# EAGLE design h-bridge mosfets ver AB (EAGLE 7.7.0)
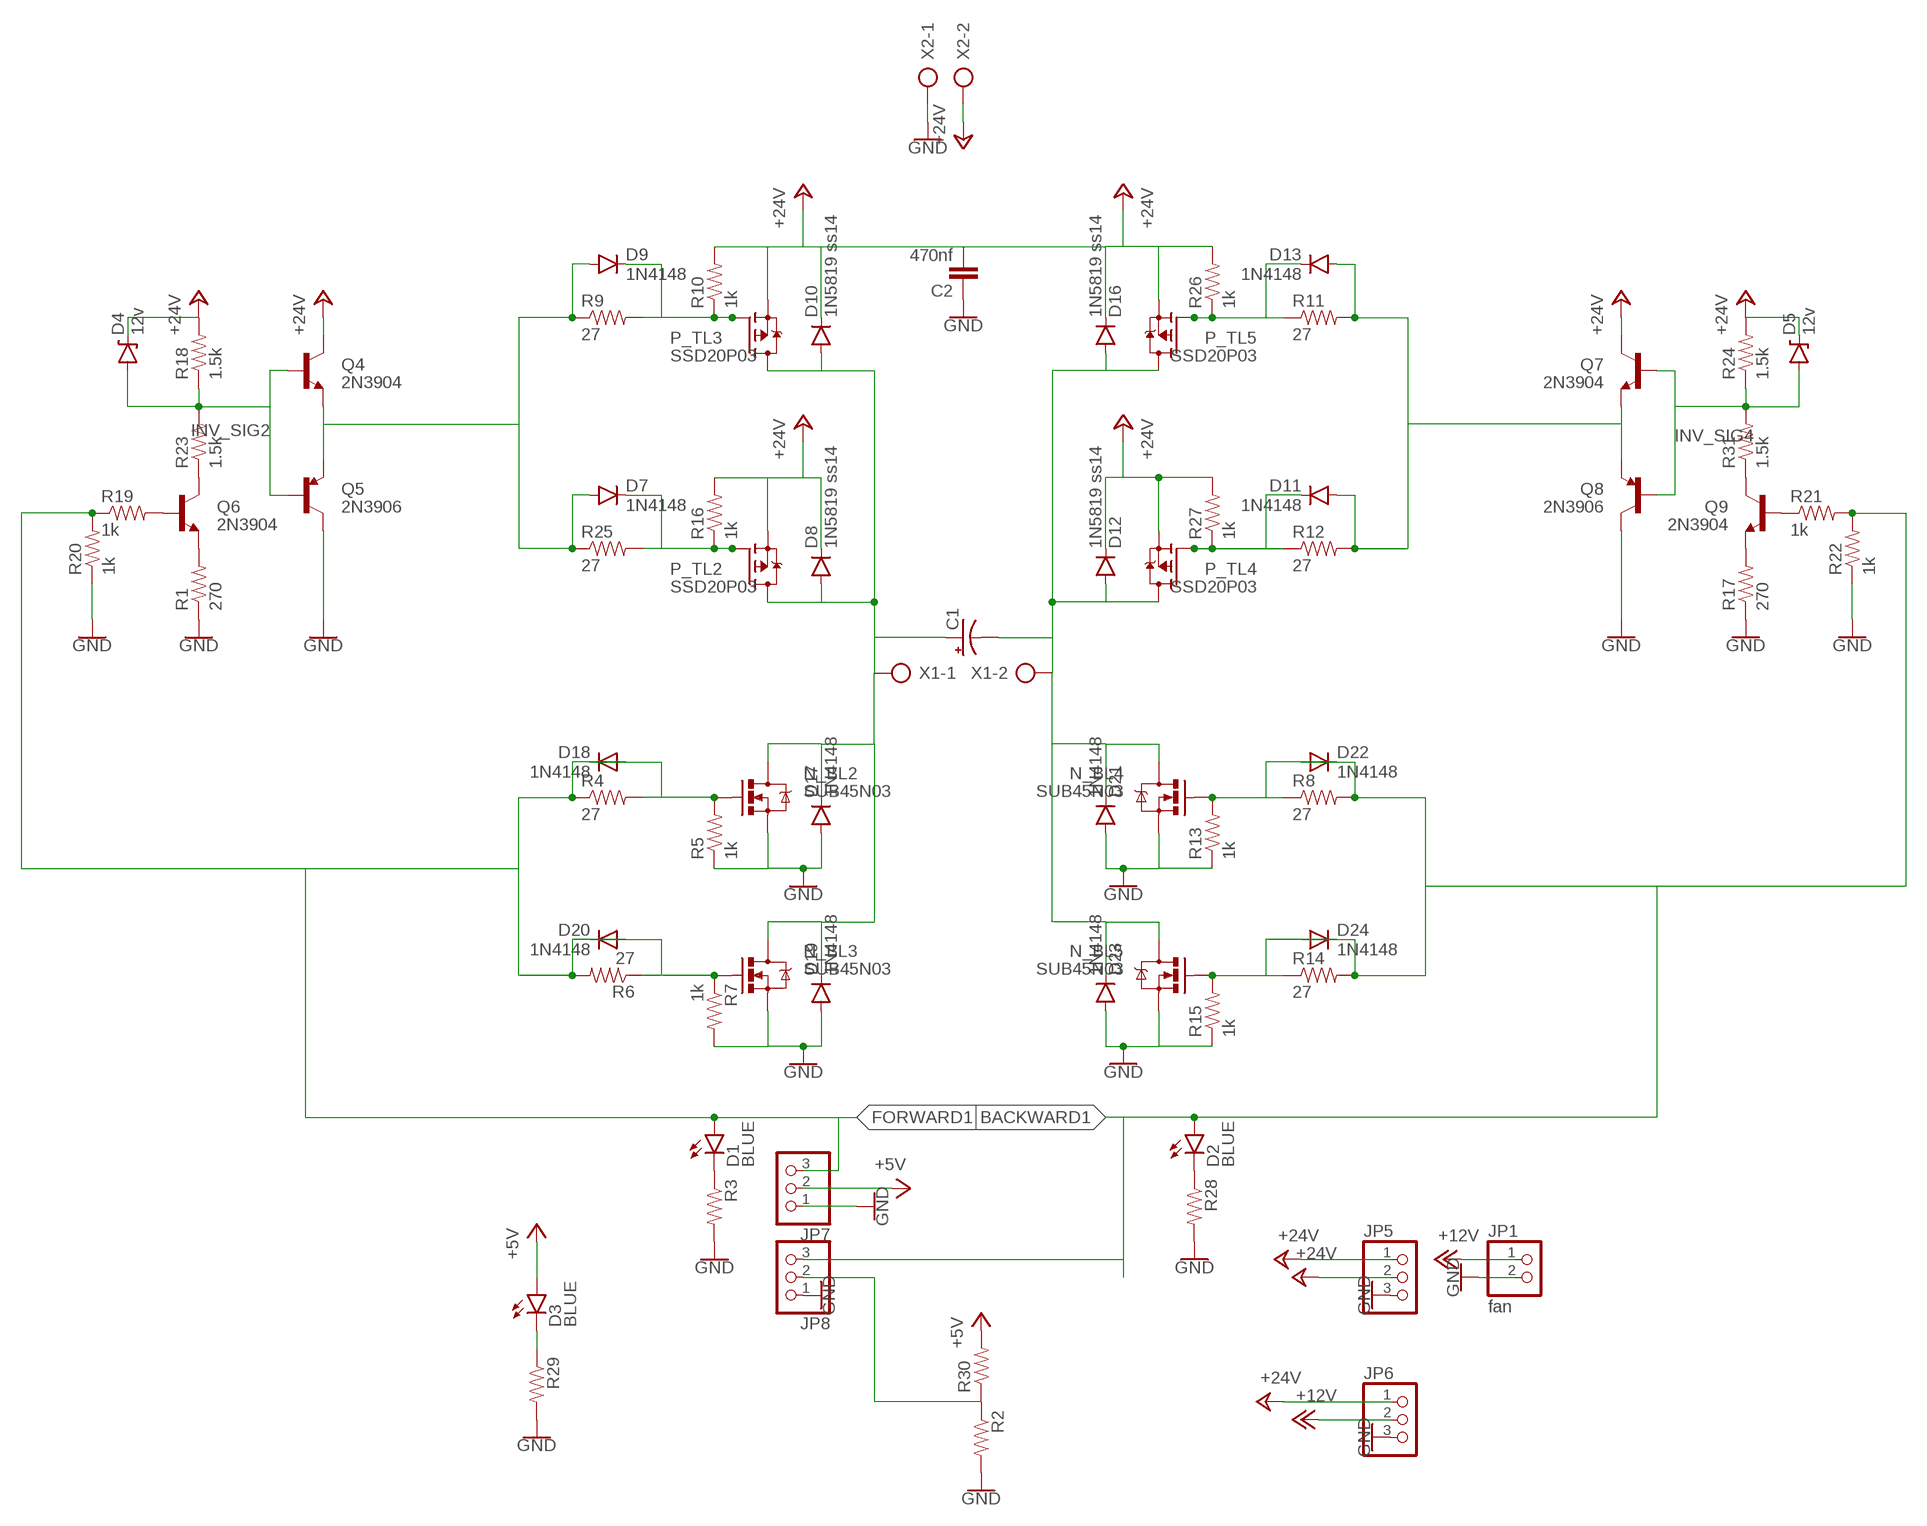
[diagram p0: schematic, sheet 1]

## Parts
C1  1000UF-25V(PTH)  [CPOL-RADIAL-1000UF-25V]
C2  470nf  1.0UF50V10%(1206)  [1206]
D1  BLUE  LED-BLUE1206  [LED-1206]
D2  BLUE  LED-BLUE1206  [LED-1206]
D3  BLUE  LED-BLUE1206  [LED-1206]
D4  12v  DIODE-ZENERSMB  [SMB-DIODE]
D5  12v  DIODE-ZENERSMB  [SMB-DIODE]
D7  1N4148  DIODESOD123  [SOD-123]
D8  1N5819 ss14  DIODESOD123  [SOD-123]
D9  1N4148  DIODESOD123  [SOD-123]
D10  1N5819 ss14  DIODESOD123  [SOD-123]
D11  1N4148  DIODESOD123  [SOD-123]
D12  1N5819 ss14  DIODESOD123  [SOD-123]
D13  1N4148  DIODESOD123  [SOD-123]
D16  1N5819 ss14  DIODESOD123  [SOD-123]
D17  1N4148  DIODESOD123  [SOD-123]
D18  1N4148  DIODESOD123  [SOD-123]
D19  1N4148  DIODESOD123  [SOD-123]
D20  1N4148  DIODESOD123  [SOD-123]
D21  1N4148  DIODESOD123  [SOD-123]
D22  1N4148  DIODESOD123  [SOD-123]
D23  1N4148  DIODESOD123  [SOD-123]
D24  1N4148  DIODESOD123  [SOD-123]
JP1  fan  PINHD-1X2  [1X02]
JP5  PINHD-1X3  [1X03]
JP6  PINHD-1X3  [1X03]
JP7  PINHD-1X3  [1X03]
JP8  PINHD-1X3  [1X03]
N_BL2  SUB45N03  MOSFET-NCHANNELPSMN7R0  [TO-263/D2PAK]
N_BL3  SUB45N03  MOSFET-NCHANNELPSMN7R0  [TO-263/D2PAK]
N_BL4  SUB45N03  MOSFET-NCHANNELPSMN7R0  [TO-263/D2PAK]
N_BL5  SUB45N03  MOSFET-NCHANNELPSMN7R0  [TO-263/D2PAK]
P_TL2  SSD20P03  FDD4141TO252  [TO252]
P_TL3  SSD20P03  FDD4141TO252  [TO252]
P_TL4  SSD20P03  FDD4141TO252  [TO252]
P_TL5  SSD20P03  FDD4141TO252  [TO252]
Q4  2N3904  TRANSISTOR_NPNMMBT5088  [SOT23-3]
Q5  2N3906  TRANSISTOR_PNPPMBT3906  [SOT23-3]
Q6  2N3904  TRANSISTOR_NPNMMBT5088  [SOT23-3]
Q7  2N3904  TRANSISTOR_NPNMMBT5088  [SOT23-3]
Q8  2N3906  TRANSISTOR_PNPPMBT3906  [SOT23-3]
Q9  2N3904  TRANSISTOR_NPNMMBT5088  [SOT23-3]
R1  270  0.3OHM-1/8W-1%(0805)  [0805]
R2  0.3OHM-1/8W-1%(0805)  [0805]
R3  0.3OHM-1/8W-1%(0805)  [0805]
R4  27  0.3OHM-1/8W-1%(0805)  [0805]
R5  1k  0.3OHM-1/8W-1%(0805)  [0805]
R6  27  0.3OHM-1/8W-1%(0805)  [0805]
R7  1k  0.3OHM-1/8W-1%(0805)  [0805]
R8  27  0.3OHM-1/8W-1%(0805)  [0805]
R9  27  0.3OHM-1/8W-1%(0805)  [0805]
R10  1k  0.3OHM-1/8W-1%(0805)  [0805]
R11  27  0.3OHM-1/8W-1%(0805)  [0805]
R12  27  0.3OHM-1/8W-1%(0805)  [0805]
R13  1k  0.3OHM-1/8W-1%(0805)  [0805]
R14  27  0.3OHM-1/8W-1%(0805)  [0805]
R15  1k  0.3OHM-1/8W-1%(0805)  [0805]
R16  1k  0.3OHM-1/8W-1%(0805)  [0805]
R17  270  0.3OHM-1/8W-1%(0805)  [0805]
R18  1.5k  0.3OHM-1/8W-1%(0805)  [0805]
R19  1k  0.3OHM-1/8W-1%(0805)  [0805]
R20  1k  0.3OHM-1/8W-1%(0805)  [0805]
R21  1k  0.3OHM-1/8W-1%(0805)  [0805]
R22  1k  0.3OHM-1/8W-1%(0805)  [0805]
R23  1.5k  0.3OHM-1/8W-1%(0805)  [0805]
R24  1.5k  0.3OHM-1/8W-1%(0805)  [0805]
R25  27  0.3OHM-1/8W-1%(0805)  [0805]
R26  1k  0.3OHM-1/8W-1%(0805)  [0805]
R27  1k  0.3OHM-1/8W-1%(0805)  [0805]
R28  0.3OHM-1/8W-1%(0805)  [0805]
R29  0.3OHM-1/8W-1%(0805)  [0805]
R30  RESISTORPTH-1/4W-VERT-KIT  [AXIAL-0.1EZ]
R31  1.5k  0.3OHM-1/8W-1%(0805)  [0805]
X1  AK300/2  [AK300/2]
X2  AK300/2  [AK300/2]

## Nets
+5V: D3.A JP7.2 R30.P$2
+12V: JP1.1 JP6.2
+24V: C2.2 D4.C D5.C D8.C D10.C D12.C D16.C JP5.1 JP5.2 JP6.1 P_TL2.2(S) P_TL3.2(S) P_TL4.2(S) P_TL5.2(S) Q4.3(C) Q7.3(C) R10.2 R16.2 R18.2 R24.2 R26.2 R27.2 X2.2
BACKWARD1: D2.A D22.A D24.A JP8.3 R8.2 R14.2 R21.2 R22.2
DR2: D11.A D13.A Q7.2(E) Q8.2(E) R11.2 R12.2
FORWARD1: D1.A D18.A D20.A JP7.3 R4.1 R6.2 R19.1 R20.2
GND: C2.1 D17.A D19.A D21.A D23.A JP1.2 JP5.3 JP6.3 JP7.1 JP8.1 N_BL2.3(S) N_BL3.3(S) N_BL4.3(S) N_BL5.3(S) Q5.3(C) Q8.3(C) R1.1 R2.2 R3.2 R5.1 R7.2 R13.1 R15.1 R17.1 R20.1 R22.1 R28.2 R29.2 X2.1
INV_SIG2: D4.A Q4.1(B) Q5.1(B) R18.1 R23.2
INV_SIG4: D5.A Q7.1(B) Q8.1(B) R24.1 R31.2
LEFT: C1.- D12.A D16.A D21.C D23.C N_BL4.2(D) N_BL5.2(D) P_TL4.3(D) P_TL5.3(D) X1.2
N$1: Q6.2(E) R1.2
N$2: Q6.1(B) R19.2
N$3: Q9.1(B) R21.1
N$4: Q9.2(E) R17.2
N$5: D1.C R3.1
N$6: D2.C R28.1
N$7: D3.C R29.1
N$8: D7.C P_TL2.1(G) R16.1 R25.2
N$9: D20.C N_BL3.1(G) R6.1 R7.1
N$10: JP8.2 R2.1 R30.P$1
N$11: D9.C P_TL3.1(G) R9.2 R10.1
N$12: D22.C N_BL4.1(G) R8.1 R13.2
N$13: Q6.3(C) R23.1
N$14: D11.C P_TL4.1(G) R12.1 R27.1
N$15: Q9.3(C) R31.1
N$16: D13.C P_TL5.1(G) R11.1 R26.1
N$17: D7.A D9.A Q4.2(E) Q5.2(E) R9.1 R25.1
N$19: D18.C N_BL2.1(G) R4.2 R5.2
N$21: D24.C N_BL5.1(G) R14.1 R15.2
RIGHT: C1.+ D8.A D10.A D17.C D19.C N_BL2.2(D) N_BL3.2(D) P_TL2.3(D) P_TL3.3(D) X1.1

## Library data of the parts
C1 = SparkFun-Capacitors:1000UF-25V(PTH): CAP-08070; PROD_ID: CAP-09538; VALUE: CAP-09538
C2 = SparkFun-Capacitors:1.0UF50V10%(1206): CAP-09822; PROD_ID: CAP-09822; VALUE: 1.0uF
D1-D3 = SparkFun-LED:LED-BLUE: Blue LEDs for production use Various blue LEDs stocked by SparkFun production 0603 - DIO-08575 Rebel - DIO-09553 1206 - DIO-09911; PROD_ID: DIO-09911
D4 D5 = SparkFun-DiscreteSemi:DIODE-ZENER: Zener Diode Production Part - 8199 3.4V Zener Voltage
D7-D13 D16-D24 = SparkFun-DiscreteSemi:DIODE: Diode These are standard reverse protection diodes and small signal diodes. SMA package can handle up to about 1A. SOD-323 can handle about 200mA. What the SOD-323 package when ordering, there are some mfgs out there that are 5-pin packages.
JP1 = pinhead2:PINHD-1X2: PIN HEADER
JP5-JP8 = pinhead:PINHD-1X3: PIN HEADER
N_BL2-N_BL5 = SparkFun-DiscreteSemi:MOSFET-NCHANNEL: Common NMOSFET Parts MFG P/N Store ID Prod ID FDD8780 TRANS-09984 SI7820DN TRANS-11055 FDS6630A IC-08089 2N7002PW TRANS-11151 FQP30N06L COM-10213 TRANS-10060 BSS123LT1G TRANS-08345 BSS138 TRANS-00830 BS170 2N7000; PROD_ID: TRANS-12437; VALUE: 100A/100V
P_TL2-P_TL5 = transistor-fet:FDD4141: P-Channel PowerTrench® MOSFET Source: FDD4141.pdf
Q4 Q6 Q7 Q9 = SparkFun-DiscreteSemi:TRANSISTOR_NPN: Generic NPN BJT MMBT2222A - TRANS-08049 (SOT-23, 1A 40V) MPSA42 - TRANS-09116 (SOT-23, 500mA 300V) MMBT5088LT1G - TRANS-11160 (SOT-23, 50 mA 30V) BC547 - COM-08928 <http://www.sparkfun.com/products/8928> (TO-92 45V 100mA) (1.Collector 2.Base 3.Emitter) 2N3904 - COM-00521 <http://www.sparkfun.com/products/521> (TO-92 40V 200mA) (1.Emitter 2.Base 3.Collector) P2N2222A - COM-12852 <http://www.sparkfun.com/products/12852> (TO-92 40V 600mA) (1.Collector 2.Base 3.Emitter); PROD_ID: TRANS-11160; VALUE: MMBT5088
Q5 Q8 = SparkFun-DiscreteSemi:TRANSISTOR_PNP: Generic PNP BJT Double check pinouts against datasheets- not all devices are the same! MMBT3906 - 40V 200mA SOT-23 (TRANS-08052) MMBT4403 - 40V 600mA SOT-23 (TRANS-09245); PROD_ID: TRANS-08052; VALUE: PMBT3906
R1-R29 R31 = SparkFun-Resistors:0.3OHM-1/8W-1%(0805): RES-11622; PROD_ID: RES-11622; VALUE: 0.3
R30 = SparkFun-Resistors:RESISTOR: Resistor Basic schematic elements and footprints for 0603, 1206, and PTH resistors.
X1 X2 = con-ptr500:AK300/2: CONNECTOR; OC_FARNELL: unknown; OC_NEWARK: unknown

## Board
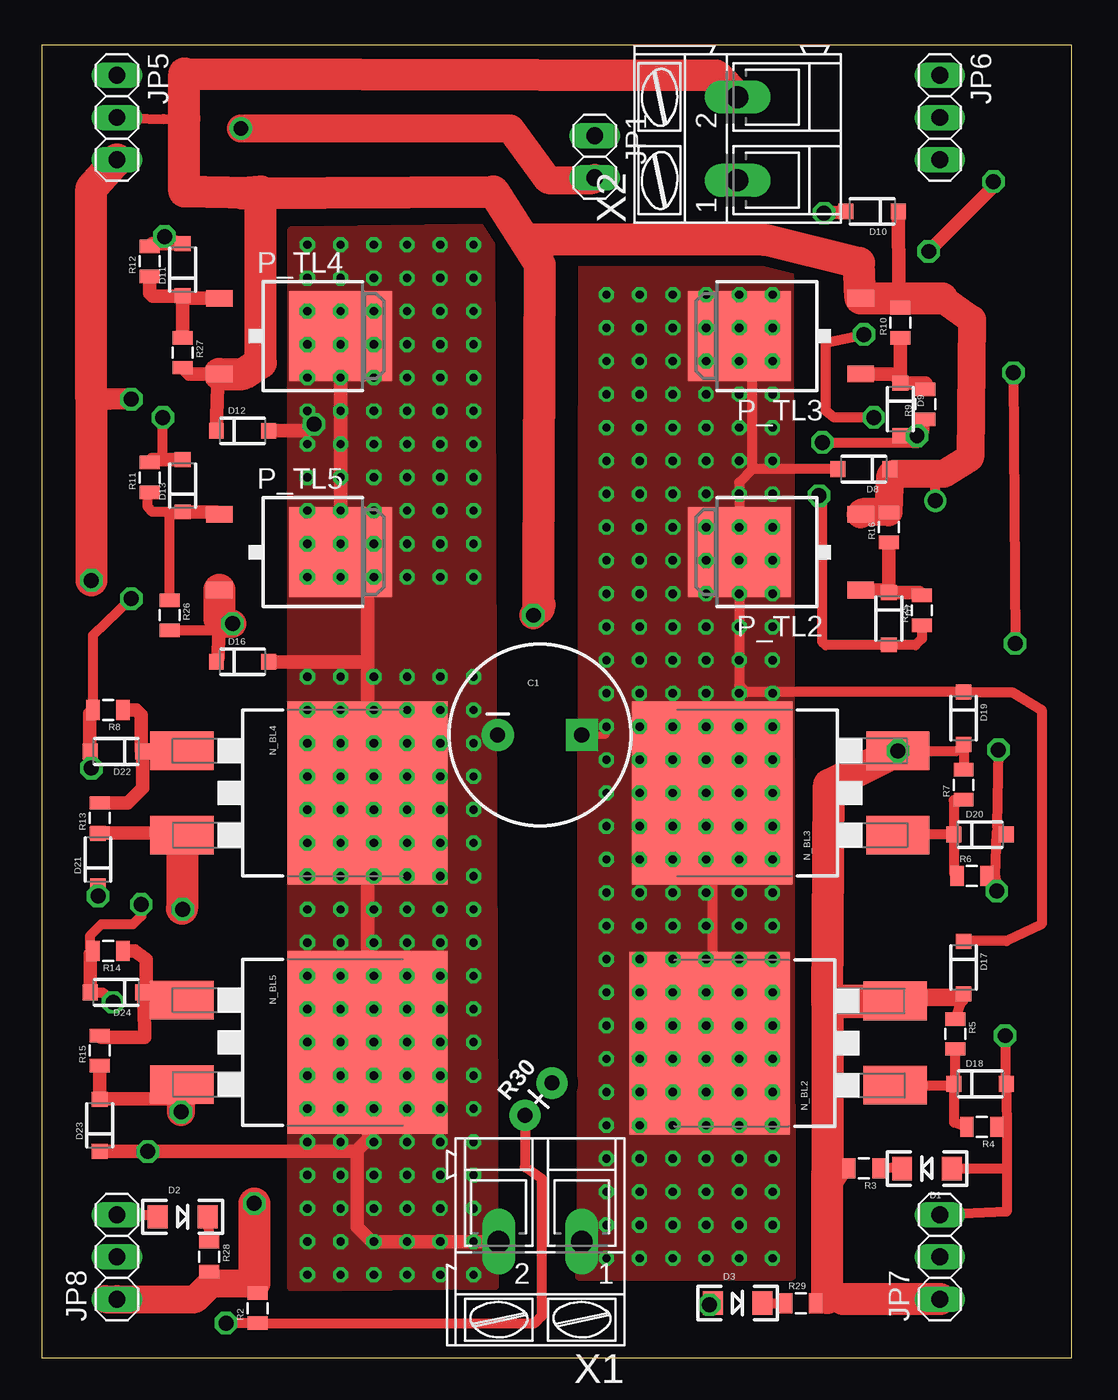
[diagram p1: board, top side]
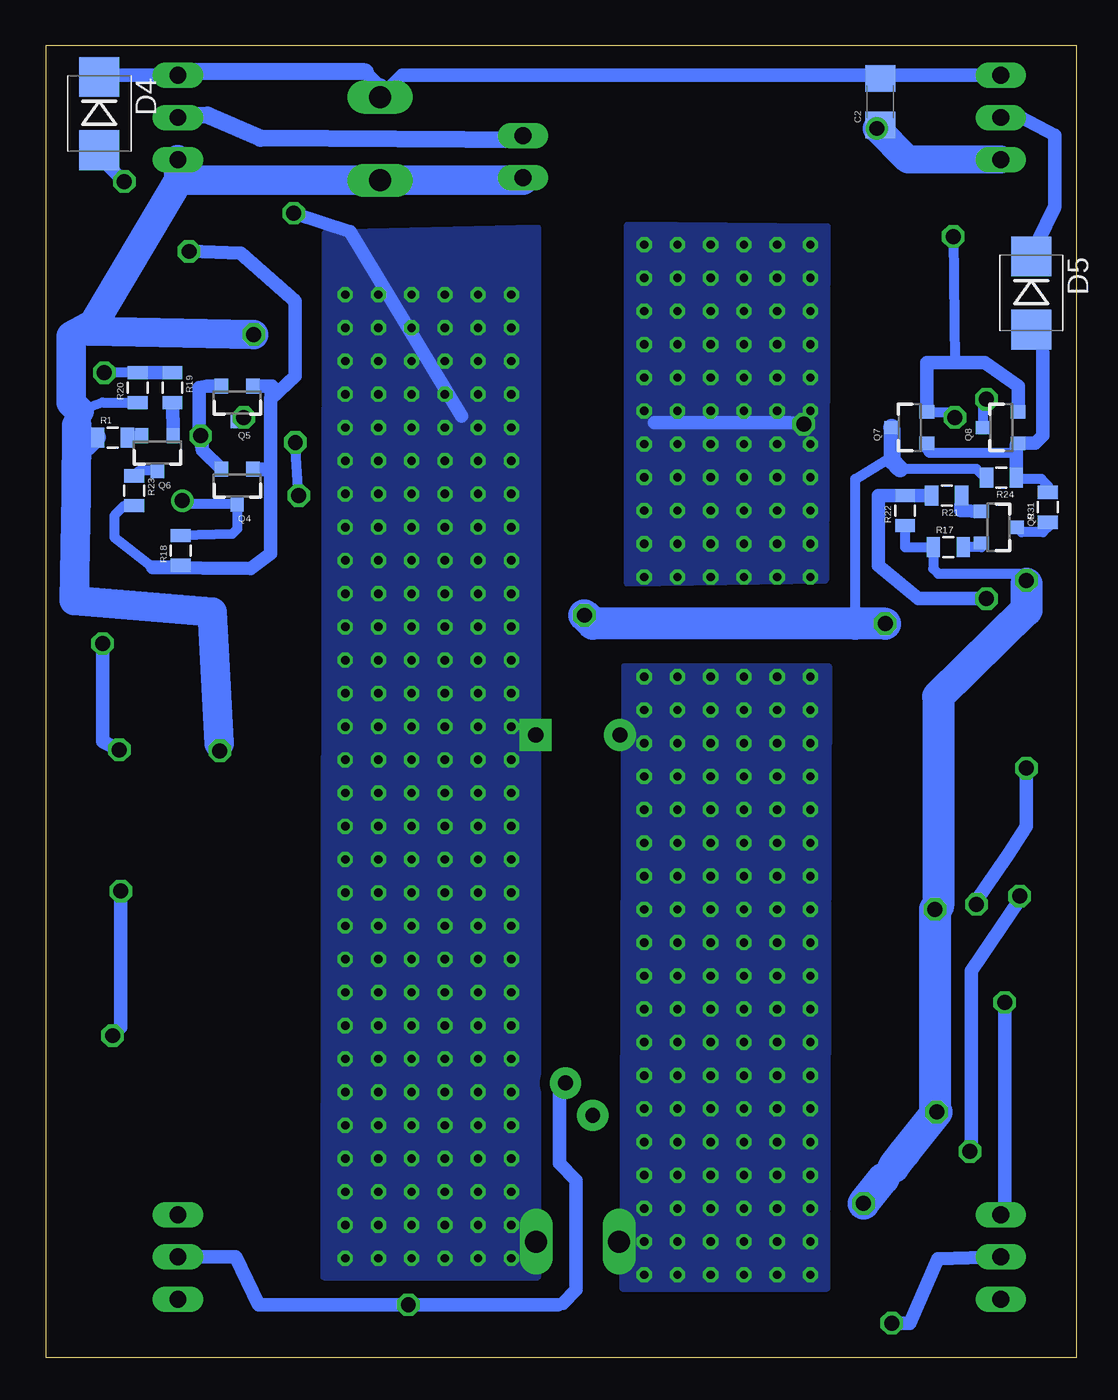
[diagram p2: board, bottom side, seen from below]

Size 62 x 79 mm. Coordinates in mm from the lower left corner, seen from the top.
Outline: 0,0 62,0 62,79 0,79 0,0
Copper layers (1*16): Top 0.035mm / dielectric 1.5mm / Bottom 0.035mm
Design rules "default": minimum track width 10mil, minimum drill 24mil, track to track 8mil, track to pad 8mil, pad to pad 8mil, via to via 8mil, smd to smd 8mil, copper to edge 40mil, drill to drill 8mil, minimum pad ring 10mil, minimum via ring 8mil, stop-mask expansion 4mil, vias tented up to drill 0mil, thermal gap 10mil

### Footprints (pad centres in the part's own frame; a part is rotated, then mirrored left to right if it is on the bottom)
CPOL-RADIAL-1000UF-25V = drill 0.9 pad 1.93 square: + 2.54,0 | drill 0.9 pad 1.93: - -2.54,0
1206 = smd 1.6 x 1.8: 1 -1.4,0; 2 1.4,0
LED-1206 = smd 1.2 x 1.4: A -1.5,0; C 1.5,0
SMB-DIODE = smd 2.4 x 2.4: A 2.2,0; C -2.2,0
SOD-123 = smd 0.9 x 0.95: A 1.575,0; C -1.575,0
1X02 = drill 1.016 long: 1 -1.27,0; 2 1.27,0
1X03 = drill 1.016 long: 1 -2.54,0; 2 0,0; 3 2.54,0
TO-263/D2PAK = smd 2.32 x 3.81: 1 -2.54,-7.045; 3 2.54,-7.045 | smd 11 x 9.65: 2 0,4.125
TO252 = smd 1 x 1.6: 1 -2.28,-4.8; 2 2.28,-4.8 | smd 5.4 x 6.2: 3 0,2.5
SOT23-3 = smd 0.8 x 0.9: 1 -0.95,-1; 2 0.95,-1; 3 0,1.1
0805 = smd 0.8 x 1.2: 1 -0.9,0; 2 0.9,0
AXIAL-0.1EZ = drill 0.9 pad 1.88: P$1 0,0; P$2 2.54,0
AK300/2 = drill 1.321 long: 1 -2.515,0; 2 2.489,0

### Placement (x,y rotation side)
C1  30,37.5 0 top
C2  11.8,75.6 90 bottom
D1  53.3,11.4 180 top
D2  8.5,8.5 0 top
D3  41.9,3.3 0 top
D4  58.8,74.9 270 bottom
D5  2.7,64.1 270 bottom
D7  51,44.5 270 top
D8  49.5,53.5 180 top
D9  51.7,57.1 270 top
D10  50,69 180 top
D11  8.5,65.5 90 top
D12  12.1,55.8 0 top
D13  8.5,52.5 90 top
D16  12.1,41.9 0 top
D17  55.5,23.5 270 top
D18  56.5,16.5 0 top
D19  55.5,38.5 270 top
D20  56.5,31.5 0 top
D21  3.4,30 90 top
D22  4.5,36.5 180 top
D23  3.5,14 90 top
D24  4.5,22 180 top
JP1  33.3,72.3 270 top
JP5  4.54,74.66 270 top
JP6  54.07,74.66 270 top
JP7  54.07,6.08 90 top
JP8  4.54,6.08 90 top
N_BL2  44.34,18.95 90 top
N_BL3  44.5,34 90 top
N_BL4  15.5,34 270 top
N_BL5  15.5,19 270 top
P_TL2  44.5,48.5 90 top
P_TL3  44.5,61.5 90 top
P_TL4  15.5,61.5 270 top
P_TL5  15.5,48.5 270 top
Q4  50.5,52.5 180 bottom
Q5  50.5,57.5 180 bottom
Q6  55.3,54.5 180 bottom
Q7  10,56 90 bottom
Q8  4.5,56 90 bottom
Q9  4.7,50 270 bottom
R1  58,55.4 0 bottom
R2  13,3 90 top
R3  49.5,11.4 180 top
R4  56.6,13.9 180 top
R5  55,19.5 270 top
R6  56,29 0 top
R7  55.5,34.5 90 top
R8  4,39 180 top
R9  53.2,57.4 90 top
R10  51.7,62.3 90 top
R11  6.5,53 90 top
R12  6.5,66 90 top
R13  3.5,32.5 90 top
R14  4,24.5 180 top
R15  3.5,18.5 90 top
R16  51,50 90 top
R17  7.7,48.8 0 bottom
R18  53.9,48.6 90 bottom
R19  54.4,58.4 270 bottom
R20  56.5,58.4 90 bottom
R21  7.8,51.9 180 bottom
R22  10.3,51 90 bottom
R23  56.7,52.2 270 bottom
R24  4.5,53 180 bottom
R25  53,45 90 top
R26  7.7,44.7 270 top
R27  8.5,60.5 270 top
R28  10.1,6.1 270 top
R29  45.7,3.3 0 top
R30  29.1,14.6 50 top
R31  1.7,51.2 90 bottom
X1  30,7 180 top
X2  41.9,73.4 90 top

### Tracks (layer width: path | path; a pad name or v marks a point on that pad's centre or on a via)
+5V  (via drill 0.9)
  Top 0.61: D3.A v40.2,3.2
  Bottom 0.61: 30.9,3.3 31.2,3.2 | R30.P$2 30.61,16.89
  Bottom 0.813: JP7.2 50.58,6.08 49.2,3.2 v40.2,3.2 31.2,3.2 | 30.61,16.89 31.1,16.4 31.1,11.7 30.1,10.7 30.1,4.1 30.9,3.3
+12V
  Bottom 0.61: 55.04,74.7 JP6.2
  Bottom 1.016: 55.04,74.7 52.3,74.8 49.1,73.4 32.7,73.3 32.7,73.57 JP1.1
+24V  (via drill 0.9)
  Top 0.61: 51.27,53.2 D8.C 51.27,53.3 53.9,53.3 53.8,53.2 v53.8,51.6 | D16.C 10.6,42.5 | JP5.2 7.34,74.56 8.6,74.6 | R26.2 10.45,43.8 10.66,43.59
  Top 0.813: D16.C 10.62,42.15 10.66,43.59 P_TL5.2 | R27.2 8.88,59.22 P_TL4.2 10.62,59.34 D12.C | 51.1,53.12 D8.C | 54.22,63.78 R10.2 | R10.2 51.6,64.58 D10.C | R10.2 54.3,63.7 | 8.6,77.3 11.5,77.3 C2.2
  Top 1.016: 29.1,67.3 30,65.8 | 10.7,44.5 10.9,44.2
  Top 1.27: 30.1,45.34 29.92,45.12 | 12.1,70.1 12.6,70.1
  Top 1.676: 51.1,53.12 R16.2 49.42,50.9 P_TL2.2 | 10.9,44.2 v11.5,44.2 | v29.6,44.7 30.1,45.34 | 54.3,63.7 56,62.5 55.9,54.2 54.3,53.2 51.27,53.2
  Top 1.93: 29.92,45.12 29.9,47.2 30,65.8 27.2,70.2 12.1,70.1 13.2,70.2 13.2,59.9 12.12,59.22 P_TL4.2 | 54.22,63.78 P_TL3.2 49.2,65.9 43.5,67.3 29.1,67.3 | P_TL5.2 10.7,44.5 | 12.6,70.1 8.6,70.2 8.6,74.6 8.6,77.3 40.59,77.2 X2.2
  Bottom 0.254: 5.5,53 R24.2 | 11.5,54 11.1,54 | C2.2 12,77 12,77.2
  Bottom 0.61: 5.5,53 6,53.5 10.6,53.5 | D5.C 2.3,67.2 | 4.5,74.7 JP5.2 | R18.2 50.8,49.6 50.5,49.9 Q4.3 53.6,51.4 v53.8,51.6 | 11.5,54 13.3,52.9 13.3,44.2
  Bottom 0.813: 41.9,76.5 42.8,77.4 | JP5.1 12,77.2 40.59,77.2 X2.2 | 2.3,67.2 1.3,69.3 1.3,73.6 3.4,74.7 4.5,74.7 | JP6.1 58.7,77.2 D4.C
  Bottom 1.016: X2.2 41.9,76.5 | 42.8,77.4 53.48,77.4 JP6.1 | 10.6,53.5 11.1,54 Q7.3
  Bottom 1.93: v11.5,44.2 13.3,44.2 29.1,44.2 v29.6,44.7
BACKWARD1  (via drill 0.9)
  Top 0.61: R8.2 3.1,43.5 v5.4,45.7 | D22.A 2.92,35.58 v3,35.5 | v6,27.3 6,26.6 5.5,26.1 3.6,26.1 2.9,25.4 2.9,24.7 R14.2 | D24.A 3.7,22 v4.3,21.4 | JP8.3 6.88,8.62 D2.A
  Top 0.813: D24.A 2.92,24.32 R14.2 | R8.2 2.9,38.8 2.9,36.52 D22.A
  Bottom 0.254: JP8.3 4.5,9 4.3,9
  Bottom 0.61: 6.1,27.4 v6,27.3
  Bottom 0.813: R21.2 R22.2 11.9,51.9 11.9,47.7 9.5,45.7 v5.4,45.7 | v3,35.5 3,32 4.1,30.3 6.1,27.4 | v4.3,21.4 4.3,9 4.3,8.79
DR2  (via drill 0.9)
  Top 0.61: D13.A 7.33,54.08 7.3,54.1 v7.3,56.6 | D11.A 7.88,67.38 v7.4,67.5
  Top 0.813: D13.A 6.67,54.08 R11.2 | D11.A 6.67,67.08 R12.2
  Bottom 0.61: v7.3,56.6 7.4,56.6 7.7,56.9 8.95,56.9 Q7.2 | v7.4,67.5 7.3,59.9
  Bottom 0.813: Q7.2 9,59.9 7.3,59.9 5.5,59.9 3.5,58.5 Q8.2
FORWARD1  (via drill 0.9)
  Top 0.61: 58.1,14 58.08,15.57 D18.A 58,16.57 v58,19.4 | 58.1,14 R4.1 | R6.2 57.4,29 | 57.4,29 57.5,31.7 58.1,31.48 D20.A 57.5,31.98 v57.6,36.6 | v58.5,59.3 v58.6,43 | 57.4,29 v57.5,28.1 | 58.1,14 58.1,11.4 | JP7.3 58.1,8.8 58.1,11.4 | D1.A 58.1,11.4
  Bottom 0.61: R20.2 v58.5,59.3
  Bottom 0.813: R20.2 R19.1 | v58.6,43 58.6,37.1 v57.6,36.6 | v57.5,28.1 57.5,19.9 v58,19.4
GND  (via drill 0.9)
  Top 0.254: R28.2 10.5,5 10.2,4.5 | R2.2 13,4 12.8,4.5
  Top 0.61: v50.1,56.6 47.7,56.6 47.2,57 47.2,61.1 v49.5,61.6 | N_BL2.3 55.47,21.49 D17.A | D17.A R5.1 | R7.2 D19.A 55.12,36.54 N_BL3.3 51.6,36.6 | R3.2 47.9,10.4 47.3,11.1 47.3,10.9 | D17.A 51.92,21.93 51.4,21.4 | 48.26,3.54 47.85,3.95 47.3,3.6 | 12.8,4.5 12.8,4.1 13.1,4 13,4 10.9,4 | v5.4,57.7 4.9,57.6 4.1,57.7
  Top 0.813: 8.5,15.6 3.52,15.6 D23.A R15.1 | D21.A R13.1 8.32,31.6 N_BL4.3 | 8.46,27.05 v8.5,27 | 8.4,16.41 N_BL5.3 | R29.2 47.85,3.95
  Top 1.27: v5.4,57.7 4.1,57.7 3,57.7
  Top 1.676: N_BL5.3 7.66,16.66 8.5,15.6 | v8.4,14.8 8.4,16.41 | 3.84,3.54 JP8.1 9.24,3.54 10.2,4.5 12.8,4.5 | v12,74 28.2,74 30.5,70.9 33.17,70.9 JP1.2
  Top 1.93: N_BL4.3 8.46,27.05 | v3,46.8 3,57.7 3,70.38 JP5.3 | N_BL2.3 48.29,21.49 47.3,21.5 47.3,21.4 | 47.3,21.4 47.3,11.1 | 51.4,21.4 47.3,21.4 | 47.3,21.4 47.4,34.5 51.6,36.6 | JP7.1 48.26,3.54 | 47.3,3.6 47.3,10.9 | v12.8,9.3 12.8,4.5
  Bottom 0.254: v12,74 C2.1 | 60.15,56.15 60.5,56.5 60,57
  Bottom 0.61: Q8.3 5.6,57.5 v5.4,57.7 | 8.3,27.2 v8.5,27 | Q5.3 50.1,56.4 v50.1,56.6 | 51.6,36.98 N_BL3.3 | R20.1 58.6,57.5 60,57 | R22.1 10.3,48.8 R17.1 8.6,47.5 8.3,47.2 3.7,47.2 | 3.7,47.2 3,46.6 | 3.7,47.2 3.2,47.2 v3,46.8 | 60.15,56.15 59.45,54.85
  Bottom 0.813: 8.5,14.9 v8.4,14.8
  Bottom 1.016: 53.84,70.89 JP6.3 | 59,62.3 59.4,61.8 | 33.3,70.89 JP1.2 | 59.45,54.85 R1.1
  Bottom 1.676: 11,11.5 11.6,10.8 | JP5.3 10.12,72.12 v12,74
  Bottom 1.778: v49.5,61.6 59.4,61.8 53.98,70.92 JP6.3 | 60.15,56.15 60.2,52 60.3,45.6 52,44.9 51.6,36.98 | 53.84,70.89 X2.1 33.3,70.89 | 60,57 60.5,57.5 60.5,61.5 59,62.3
  Bottom 1.93: v8.5,27 8.5,14.9 | 8.3,27.2 8.3,39.8 3,45 3,46.6 | v8.4,14.8 10.3,12.4 11,11.5 | 11.6,10.8 v12.8,9.3
  other vias: 51.55,36.54
INV_SIG2  (via drill 0.9)
  Top 0.813: v57.3,70.8 57.3,70.5 v53.4,66.6
  Bottom 0.61: Q4.1 49.45,53.4 48.5,53.3 48.5,53.5 | R23.2 57.3,51.3 57.9,50.7 57.9,49.4 55.6,47.6 | R18.1 55.47,47.7 55.6,47.57
  Bottom 0.813: Q5.1 48.4,58.5 48.5,57.7 | 48.5,57.7 48.5,53.5 Q4.1 | 48.5,53.3 48.5,48.4 49.7,47.5 55.6,47.57 55.6,47.6 | D4.A 58.8,72.3 v57.3,70.8 | v53.4,66.6 50.3,66.5 47,63.6 47,59.1 48.5,57.7
INV_SIG4
  Bottom 0.61: Q7.1 9,54.7 8.9,54.5 3.8,54.5 3.6,54.4 | 2,60.5 D5.A | R31.2 1.7,52.5 2.1,52.9 3.5,52.9 R24.1
  Bottom 0.813: R24.1 3.6,54.4 3.6,54.95 Q8.1 2.45,55.05 2,55.5 2,60.5
LEFT  (via drill 0.5, 0.9)
  Top 0.61: D21.C v3.4,27.8
  Top 0.813: D23.C v6.4,12.43 18.93,12.43 | 18.93,12.43 19.7,13.2 19.7,18.93 N_BL5.2 N_BL4.2 19.62,41.9 | X1.2 19.9,7 19,7.9 19,12.35 18.93,12.43 | 19.62,41.9 19.62,46.88 P_TL5.3 P_TL4.3 | D16.A 19.62,41.9 | D12.A 16,55.8 v16.4,56.2
  Bottom 0.61: 6.3,12.82 v6.4,12.43
  Bottom 0.813: v3.4,27.8 3.4,27.6 6.3,23.3 6.3,12.82 | v16.4,56.2 17.3,56.3 25.4,56.3
  other vias: 16,67 18,67 20,67 22,67 24,67 26,67 16,65 18,65 20,65 22,65 24,65 26,65 16,63 18,63 20,63 22,63 24,63 26,63 16,61 18,61 20,61 22,61 24,61 26,61 16,59 18,59 20,59 22,59 24,59 26,59 16,57 18,57 20,57 22,57 24,57 26,57 16,55 18,55 20,55 22,55 24,55 26,55 16,53 18,53 20,53 22,53 24,53 26,53 16,41 18,41 20,41 22,41 24,41 26,41 16,39 18,39 20,39 22,39 24,39 26,39 16,37 18,37 20,37 22,37 24,37 26,37 16,35 18,35 20,35 22,35 24,35 26,35 16,33 18,33 20,33 22,33 24,33 26,33 16,31 18,31 20,31 22,31 24,31 26,31 16,29 18,29 20,29 22,29 24,29 26,29 16,27 18,27 20,27 22,27 24,27 26,27 16,25 18,25 20,25 22,25 24,25 26,25 16,23 18,23 20,23 22,23 24,23 26,23 16,21 18,21 20,21 22,21 24,21 26,21 16,19 18,19 20,19 22,19 24,19 26,19 16,17 18,17 20,17 22,17 24,17 26,17 16,15 18,15 20,15 22,15 24,15 26,15 16,13 18,13 20,13 22,13 24,13 26,13 16,11 18,11 20,11 22,11 24,11 26,11 16,51 18,51 20,51 22,51 24,51 26,51 16,49 18,49 20,49 22,49 24,49 26,49 16,47 18,47 20,47 22,47 24,47 26,47 16,9 18,9 20,9 22,9 24,9 26,9 16,7 18,7 20,7 22,7 24,7 26,7 16,5 18,5 20,5 22,5 24,5 26,5
  pour Top (isolate 0.61, no thermals): 27.3,4.3 15,4.2 15,67.9 27.1,68.1
  pour Bottom (isolate 0.61, no thermals): 14.9,41.6 27.2,41.6 27.3,4.2 15,4.2
  pour Bottom: 15.1,46.8 27,46.6 27,68.2 15,68.1
N$1
  Bottom 0.61: Q6.2 57,55.5 R1.2
N$2
  Bottom 0.813: Q6.1 54.35,56.25 R19.2
N$3
  Bottom 0.813: R21.1 6.95,51 Q9.1
N$4
  Bottom 0.61: Q9.2 5.7,48.8 R17.2
N$5
  Top 0.61: R3.1 51.5,11.5 D1.C
N$6
  Top 0.61: D2.C R28.1
N$7
  Top 0.61: D3.C R29.1
N$8
  Top 0.813: P_TL2.1 50.85,46.22 D7.C | D7.C R16.1 | D7.C 52.83,46.08 R25.2
N$9
  Top 0.61: D20.C 54.92,29.18 R6.1 | R7.1 54.9,33.58 D20.C | D20.C 51.59,31.5 N_BL3.1
N$10  (via drill 0.9)
  Top 0.61: v11.1,2.1 R2.1 29.7,2.1 30.1,2.5 30.1,10.8 29.1,11.5 R30.P$1
  Bottom 0.813: JP8.2 8.32,5.98 10,2.1 v11.1,2.1
N$11
  Top 0.813: P_TL3.1 51.35,59.22 D9.C | D9.C 53.23,58.67 R9.2 | R10.1 D9.C
N$12
  Top 0.61: D22.C 8.41,36.5 N_BL4.1
  Top 0.813: R8.1 5.7,39 6,38.7 6,36.58 D22.C 6.1,36.48 6.1,34.3 5.2,33.4 R13.2
N$13
  Bottom 0.61: Q6.3 56.4,53.4 R23.1
N$14
  Top 0.813: P_TL4.1 8.64,63.78 D11.C | D11.C R27.1 | R12.1 6.5,64.1 6.7,63.9 8.47,63.9 D11.C
N$15
  Bottom 0.61: R31.1 1.7,50 2,49.7 3.3,49.7 Q9.3
N$16
  Top 0.61: D13.C 7.9,50.92 | 7.9,50.92 6.67,50.92 6.4,51.2 6.4,52 R11.1 | R26.1 7.7,50.73 7.9,50.92
  Top 0.813: D13.C 10.55,50.92 P_TL5.1
N$17  (via drill 0.9)
  Top 0.61: v46.8,51.9 47,51.5 47,43.1 47.2,42.9 51.02,42.9 52.6,42.9 53,43.3 R25.1 | R9.1 53.1,55.7 v52.7,55.5 52.67,55.42 52.8,55.1 51.8,55.1 | D9.A 51.5,55.4 51.8,55.1 | v47,55.1 51.8,55.1
  Top 0.813: 51.02,42.9 D7.A
  Bottom 0.61: v46.8,51.9 v47,55.1
  Bottom 0.813: Q5.2 52.3,58.5 52.8,58.4 52.8,55.65 52.58,54.62 | 52.58,54.62 Q4.2 | v52.7,55.5 52.58,54.62
N$19
  Top 0.61: N_BL2.1 54.84,16.41 D18.C | D18.C 54.92,14.18 R4.2 | D18.C 55,16.5 R5.2
N$21
  Top 0.813: N_BL5.1 6.54,21.54 D24.C | D24.C 6.17,21.18 6.2,19.3 3.6,19.3 R15.2 | R14.1 5.6,24.5 6.3,24 6.3,22.02 D24.C
RIGHT  (via drill 0.5, 0.9)
  Top 0.406: C1.+ 34,37.5 v34,38
  Top 0.61: D8.A 42.8,53.5 | 42.8,53.5 42,52.7 P_TL2.3 42,40.5 | 42.8,53.5 42.8,60.7 P_TL3.3 | 48.12,68.9 D10.A | 42,40.5 42,35.3 40,33.3 40,33.62 N_BL3.2 40.38,19.11 N_BL2.2 | D17.C 55.52,25.1 58.1,25.1 60.2,26.1 60.2,39 58.42,40.08 D19.C 42.42,40.08 42,40.5
  Top 0.813: 39.77,18.5 N_BL2.2 | D10.A v47.1,68.9
  Bottom 0.813: v47.1,68.9 43.7,67.8 37,56.7
  other vias: 34,64 36,64 38,64 40,64 42,64 44,64 34,62 36,62 38,62 40,62 42,62 44,62 34,60 36,60 38,60 40,60 42,60 44,60 34,58 36,58 38,58 40,58 42,58 44,58 34,56 36,56 38,56 40,56 42,56 44,56 34,54 36,54 38,54 40,54 42,54 44,54 34,52 36,52 38,52 40,52 42,52 44,52 34,50 36,50 38,50 40,50 42,50 44,50 34,48 36,48 38,48 40,48 42,48 44,48 34,46 36,46 38,46 40,46 42,46 44,46 34,44 36,44 38,44 40,44 42,44 44,44 34,42 36,42 38,42 40,42 42,42 44,42 34,40 36,40 38,40 40,40 42,40 44,40 36,38 38,38 40,38 42,38 44,38 34,36 36,36 38,36 40,36 42,36 44,36 34,34 36,34 38,34 40,34 42,34 44,34 34,32 36,32 38,32 40,32 42,32 44,32 34,30 36,30 38,30 40,30 42,30 44,30 34,28 36,28 38,28 40,28 42,28 44,28 34,26 36,26 38,26 40,26 42,26 44,26 34,24 36,24 38,24 40,24 42,24 44,24 34,22 36,22 38,22 40,22 42,22 44,22 34,20 36,20 38,20 40,20 42,20 44,20 34,18 36,18 38,18 40,18 42,18 44,18 34,16 36,16 38,16 40,16 42,16 44,16 34,14 36,14 38,14 40,14 42,14 44,14 34,12 36,12 38,12 40,12 42,12 44,12 34,10 36,10 38,10 40,10 42,10 44,10 34,8 36,8 38,8 40,8 42,8 44,8 34,6 36,6 38,6 40,6 42,6 44,6 32.5,37.5
  pour Top (isolate 0.61, no thermals): 32.3,4.9 45.2,4.9 45.1,67.3 32.5,67.5 32.4,6.4
  pour Bottom (isolate 0.61, no thermals): 32.4,68 45.2,67.7 45.3,4.9 32.4,4.9